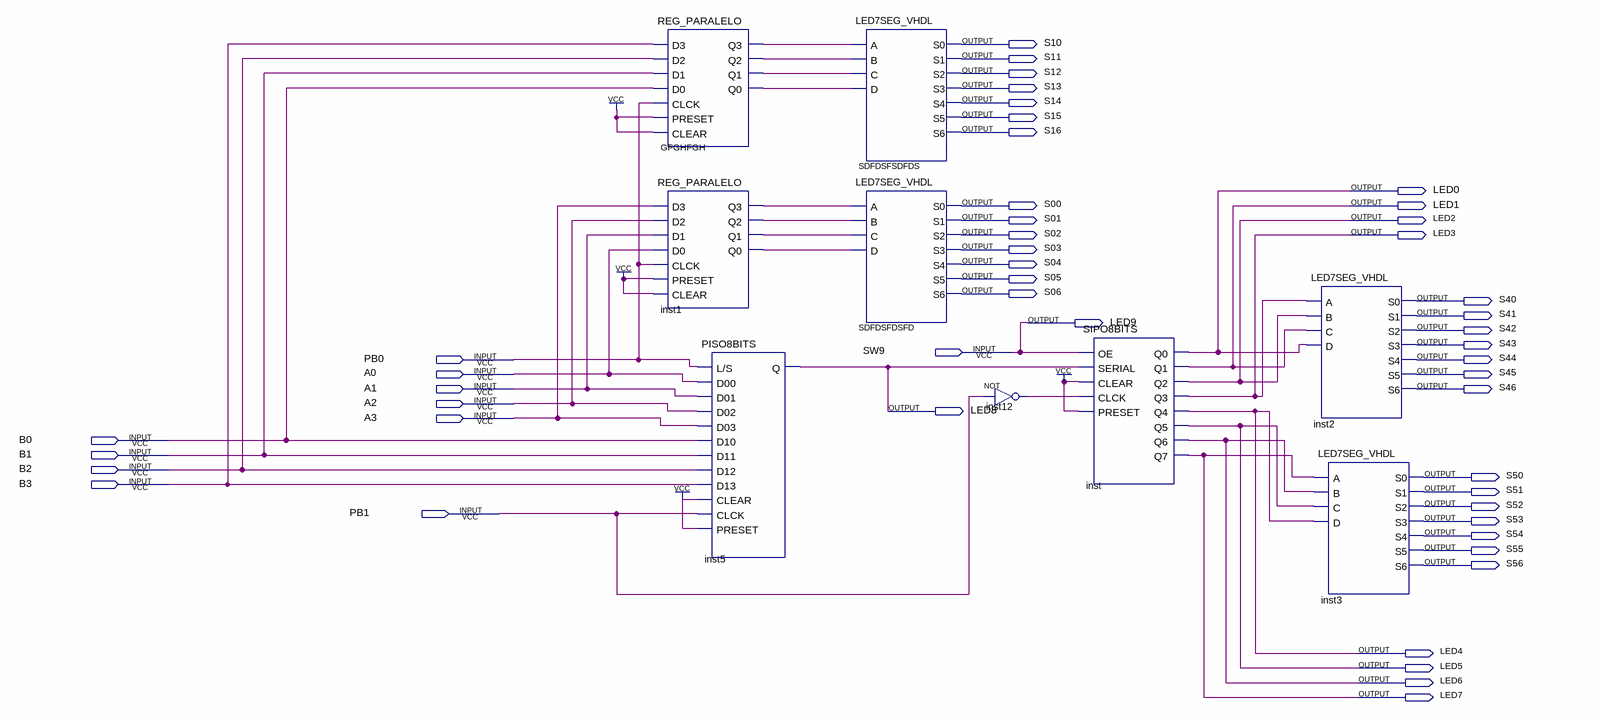
[diagram p0: schematic sheet]
// Quartus schematic SOMADOR4BITS7SEG.bdf as structural Verilog: 9 symbols, 49 pins
module SOMADOR4BITS7SEG (
  input  SW9,
  input  PB0,
  input  A0,
  input  A1,
  input  A2,
  input  A3,
  input  B0,
  input  B1,
  input  B2,
  input  B3,
  input  PB1,
  output S10,
  output S11,
  output S12,
  output S13,
  output S14,
  output S15,
  output S16,
  output LED0,
  output S00,
  output LED1,
  output S01,
  output LED2,
  output S02,
  output LED3,
  output S03,
  output S04,
  output S05,
  output S06,
  output S40,
  output S41,
  output LED9,
  output S42,
  output S43,
  output S44,
  output S45,
  output S46,
  output LED8,
  output S50,
  output S51,
  output S52,
  output S53,
  output S54,
  output S55,
  output S56,
  output LED4,
  output LED5,
  output LED6,
  output LED7
);

  wire GFGHFGH_q0, GFGHFGH_q1, GFGHFGH_q2, GFGHFGH_q3, inst1_q0, inst1_q1, inst1_q2, inst1_q3, inst12_out;

  REG_PARALELO GFGHFGH (
    .D3(B3), .D2(B2), .D1(B1), .D0(B0), .CLCK(PB0), .PRESET(1'b1), .CLEAR(1'b1), .Q3(GFGHFGH_q3),
    .Q2(GFGHFGH_q2), .Q1(GFGHFGH_q1), .Q0(GFGHFGH_q0));
  REG_PARALELO inst1 (
    .D3(A3), .D2(A2), .D1(A1), .D0(A0), .CLCK(PB0), .PRESET(1'b1), .CLEAR(1'b1), .Q3(inst1_q3),
    .Q2(inst1_q2), .Q1(inst1_q1), .Q0(inst1_q0));
  PISO8BITS inst5 (
    .\L/S (PB0), .D00(A0), .D01(A1), .D02(A2), .D03(A3), .D10(B0), .D11(B1), .D12(B2), .D13(B3),
    .CLEAR(1'b1), .CLCK(PB1), .PRESET(1'b1), .Q(LED8));
  LED7SEG_VHDL SDFDSFSDFDS (
    .A(GFGHFGH_q3), .B(GFGHFGH_q2), .C(GFGHFGH_q1), .D(GFGHFGH_q0), .S0(S10), .S1(S11), .S2(S12), .S3(S13),
    .S4(S14), .S5(S15), .S6(S16));
  LED7SEG_VHDL SDFDSFDSFD (
    .A(inst1_q3), .B(inst1_q2), .C(inst1_q1), .D(inst1_q0), .S0(S00), .S1(S01), .S2(S02), .S3(S03), .S4(S04),
    .S5(S05), .S6(S06));
  not inst12 (inst12_out, PB1);
  SIPO8BITS inst (
    .OE(SW9), .SERIAL(LED8), .CLEAR(1'b1), .CLCK(inst12_out), .PRESET(1'b1), .Q0(LED0), .Q1(LED1), .Q2(LED2),
    .Q3(LED3), .Q4(LED4), .Q5(LED5), .Q6(LED6), .Q7(LED7));
  LED7SEG_VHDL inst2 (
    .A(LED3), .B(LED2), .C(LED1), .D(LED0), .S0(S40), .S1(S41), .S2(S42), .S3(S43), .S4(S44), .S5(S45),
    .S6(S46));
  LED7SEG_VHDL inst3 (
    .A(LED7), .B(LED6), .C(LED5), .D(LED4), .S0(S50), .S1(S51), .S2(S52), .S3(S53), .S4(S54), .S5(S55),
    .S6(S56));

  assign LED9 = SW9;
endmodule
